# Altium schematic sheet [03]-CONNECTOR,SBC.SchDoc: S32K1_CONTROLLER (part 2 of 3)
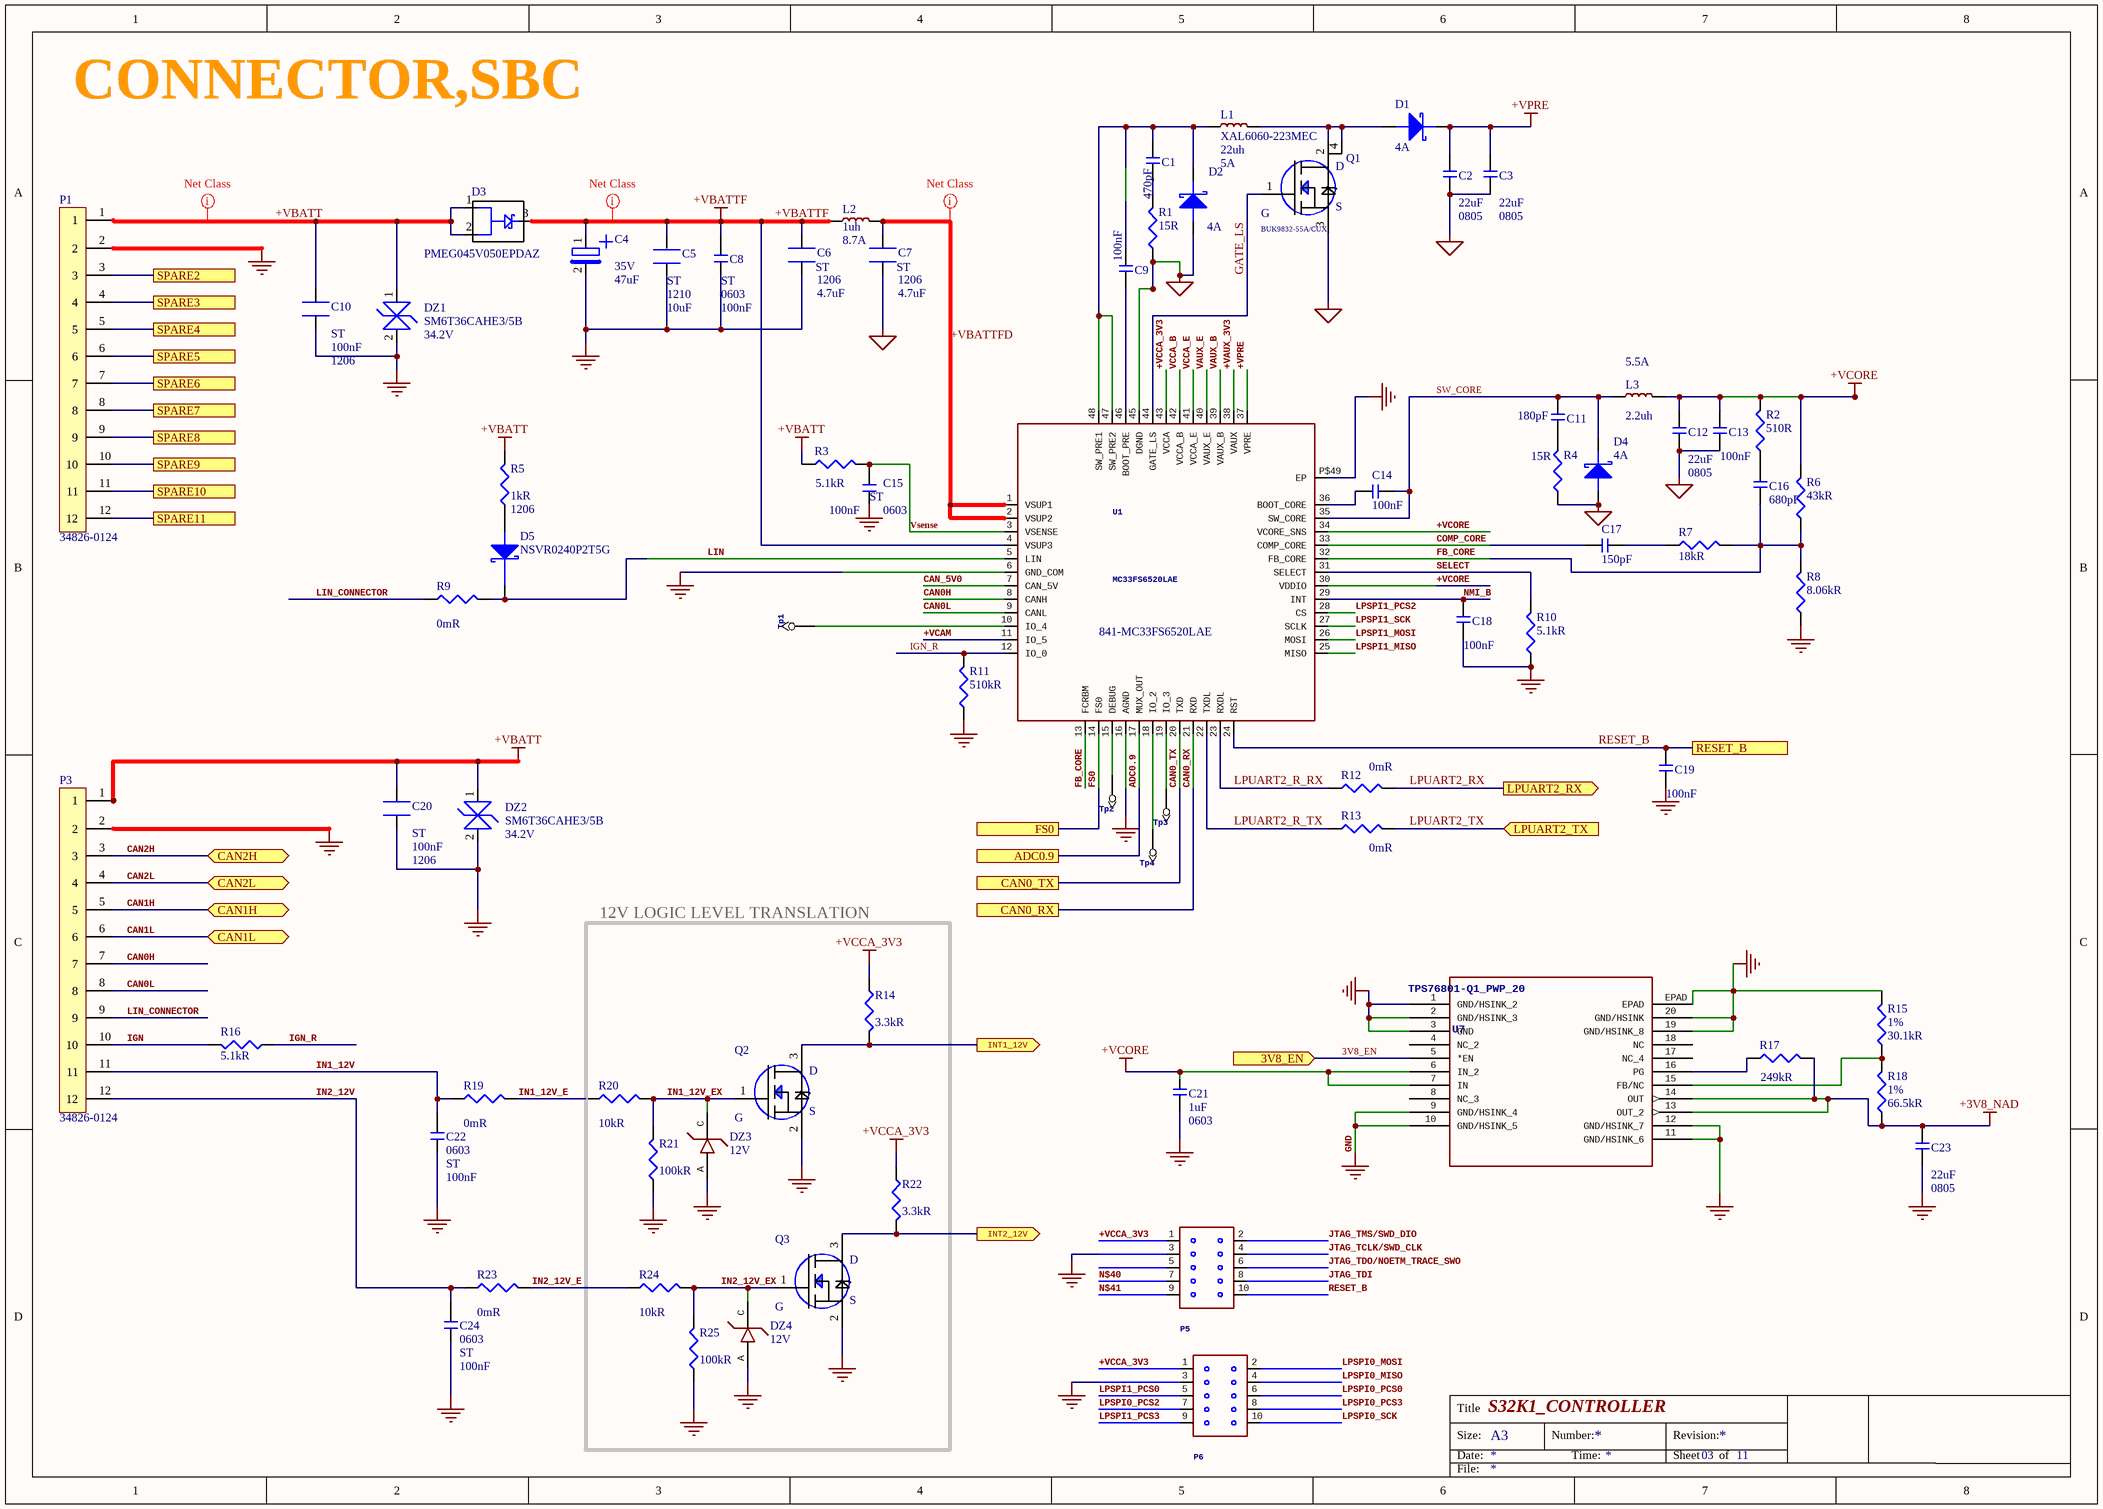
[diagram p1: [03]-CONNECTOR,SBC.SchDoc]
## Library data of the parts
C1 = C0402S471K3RACAUTO: Cap Ceramic 470pF 25V X7R 10% SMD 0402 125°C Paper T/R; Manufacturer: KEMET; Supplier 1: Digikey; Manufacturer Part Number: C0402S471K3RACAUTO; Stock 1: 10000; Pricing 1: 1 = 0.53000, 10 = 0.37200, 100 = 0.24480, 500 = 0.18132, 1000 = 0.15412, 2500 = 0.14506, 5000 = 0.13599 (USD); ComponentLink1URL: http://datasheet.octopart.com/C0402S471K3RACAUTO-KEMET-datasheet-84169754.pdf; ComponentLink1Description: http://datasheet.octopart.com/C0402S471K3RACAUTO-KEMET-datasheet-84169754.pdf; Supplier Part Number 1: 399-19394-1-ND
C2 C3 C12 C23 = GRT21BR61E226ME13L: 0805 22 uF 25 V ±20% Tolerance X5R Multilayer Ceramic Capacitor; Manufacturer: Murata; Voltage Rating: 25V; Supplier 1: Digi-Key; Manufacturer Part Number: GRT21BR61E226ME13L; Stock 1: 494235; Pricing 1: 1 = 0.73000, 10 = 0.51300, 100 = 0.33770, 500 = 0.25018, 1000 = 0.21265 (USD); Mount: Surface Mount; Case Code (Metric): 2012; Case Code (Imperial): 0805; Min Operating Temperature: -55°C; Max Operating Temperature: 85°C; Packaging: Tape and Reel; Tolerance: 20%; Length: 0.079inch; Width: 0.049inch; Thickness: 0.057inch; Ratings: AEC-Q200; ComponentLink1URL: http://datasheet.octopart.com/GRT21BR61E226ME13L-Murata-datasheet-82944879.pdf?src-supplier=Future+Electronics; ComponentLink1Description: http://datasheet.octopart.com/GRT21BR61E226ME13L-Murata-datasheet-82944879.pdf?src-supplier=Future+Electronics; Supplier Part Number 1: 490-12389-1-ND
C4 = EMZA350ADA470MF61G: Aluminum Electrolytic Capacitor 47UF 35V 20%, SMD, Full Reel; Manufacturer: United Chemi-Con; Dielectric Material: Aluminium; Ripple Current: 240mA; Impedance: 360mR; Leakage Current: 3uA; Life (Hours): 2000Hour; Lead Diameter: 0.8mm; Supplier 1: Digi-Key; Manufacturer Part Number: EMZA350ADA470MF61G; Stock 1: 43543; Pricing 1: 1 = 0.70000, 10 = 0.49500, 100 = 0.32600, 500 = 0.24150 (USD); Mount: Surface Mount; Case/Package: Radial; Number of Pins: 61; Min Operating Temperature: -55°C; Max Operating Temperature: 105°C; Tolerance: 20%; Package Quantity: 1; Packaging: Tape and Reel; ESR (Equivalent Series Resistance): 360mR; Voltage Rating (DC): 35V; Ripple Current (AC): 240mA; Termination: SMD/SMT; Voltage: 35V; Diameter: 6.3mm; Length: 5.8mm; Height: 5.8mm; Lead Pitch: 1.9mm; Height - Seated (Max): 0.228inch; REACH SVHC: Unknown; Lead Free: Lead Free; ComponentLink1URL: http://www.farnell.com/datasheets/1470278.pdf?src-supplier=Element14; ComponentLink1Description: http://www.farnell.com/datasheets/1470278.pdf?src-supplier=Element14; ComponentLink2URL: http://datasheet.octopart.com/EMZA350ADA470MF61G-United-Chemi-Con-datasheet-10742166.pdf?src-supplier=Element14; ComponentLink2Description: http://datasheet.octopart.com/EMZA350ADA470MF61G-United-Chemi-Con-datasheet-10742166.pdf?src-supplier=Element14; ComponentLink3URL: http://datasheet.octopart.com/EMZA350ADA470MF61G-United-Chemi-Con-datasheet-23700410.pdf?src-supplier=Newark; ComponentLink3Description: http://datasheet.octopart.com/EMZA350ADA470MF61G-United-Chemi-Con-datasheet-23700410.pdf?src-supplier=Newark; ComponentLink4URL: http://datasheet.octopart.com/EMZA350ADA470MF61G-United-Chemi-Con-datasheet-14460521.pdf?src-supplier=Electro+Sonic; ComponentLink4Description: http://datasheet.octopart.com/EMZA350ADA470MF61G-United-Chemi-Con-datasheet-14460521.pdf?src-supplier=Electro+Sonic; ComponentLink5URL: http://datasheet.octopart.com/EMZA350ADA470MF61G-United-Chemi-Con-datasheet-15930.pdf?src-supplier=Digi-Key; ComponentLink5Description: http://datasheet.octopart.com/EMZA350ADA470MF61G-United-Chemi-Con-datasheet-15930.pdf?src-supplier=Digi-Key; ComponentLink6URL: http://datasheet.octopart.com/EMZA350ADA470MF61G-United-Chemi-Con-datasheet-8459204.pdf?src-supplier=Element14; ComponentLink6Description: http://datasheet.octopart.com/EMZA350ADA470MF61G-United-Chemi-Con-datasheet-8459204.pdf?src-supplier=Element14; ComponentLink7URL: http://datasheet.octopart.com/EMZA350ADA470MF61G-United-Chemi-Con-datasheet-8814951.pdf?src-supplier=Element14; ComponentLink7Description: http://datasheet.octopart.com/EMZA350ADA470MF61G-United-Chemi-Con-datasheet-8814951.pdf?src-supplier=Element14; ComponentLink8URL: http://datasheet.octopart.com/EMZA350ADA470MF61G-United-Chemi-Con-datasheet-21267361.pdf?src-supplier=Newark; ComponentLink8Description: http://datasheet.octopart.com/EMZA350ADA470MF61G-United-Chemi-Con-datasheet-21267361.pdf?src-supplier=Newark; ComponentLink9URL: http://datasheet.octopart.com/EMZA350ADA470MF61G-United-Chemi-Con-datasheet-33025258.pdf?src-supplier=Electro+Sonic; ComponentLink9Description: http://datasheet.octopart.com/EMZA350ADA470MF61G-United-Chemi-Con-datasheet-33025258.pdf?src-supplier=Electro+Sonic; ComponentLink10URL: http://datasheet.octopart.com/EMZA350ADA470MF61G-United-Chemi-Con-datasheet-43457141.pdf?src-supplier=Future+Electronics; ComponentLink10Description: http://datasheet.octopart.com/EMZA350ADA470MF61G-United-Chemi-Con-datasheet-43457141.pdf?src-supplier=Future+Electronics; ComponentLink11URL: http://datasheet.octopart.com/EMZA350ADA470MF61G-United-Chemi-Con-datasheet-62043274.pdf?src-supplier=Electro+Sonic; ComponentLink11Description: http://datasheet.octopart.com/EMZA350ADA470MF61G-United-Chemi-Con-datasheet-62043274.pdf?src-supplier=Electro+Sonic; Supplier Part Number 1: 565-2558-1-ND
C5 = CGA6P3X7S1H106K250AE: Cap Ceramic 10uF 50V X7S 10% Pad SMD 1210 Soft Termination 125C Automotive T/R; Manufacturer: TDK; Supplier 1: Digi-Key; Manufacturer Part Number: CGA6P3X7S1H106K250AE; Stock 1: 58465; Pricing 1: 1 = 1.84000, 10 = 1.44900, 100 = 1.08680, 500 = 0.82110 (USD); Mount: Surface Mount; Case/Package: 1210; Weight: 0.000564oz; Case Code (Metric): 3225; Min Operating Temperature: -55°C; Max Operating Temperature: 125°C; Packaging: Tape and Reel; Voltage Rating: 50V; Voltage Rating (DC): 50V; Tolerance: 10%; Package Quantity: 1000; Dielectric: X7S; Termination: SMD/SMT; Features: Soft Termination; Length: 3.2mm; Height: 2.5mm; Width: 2.5mm; Thickness: 0.11inch; Depth: 2.5mm; Ratings: AEC-Q200; REACH SVHC: No SVHC; Lead Free: Lead Free; ComponentLink1URL: http://www.mouser.com/ds/2/400/lcc_commercial_soft_en-775842.pdf?src-supplier=Mouser; ComponentLink1Description: http://www.mouser.com/ds/2/400/lcc_commercial_soft_en-775842.pdf?src-supplier=Mouser; ComponentLink2URL: http://www.farnell.com/datasheets/1863333.pdf?src-supplier=Element14; ComponentLink2Description: http://www.farnell.com/datasheets/1863333.pdf?src-supplier=Element14; ComponentLink3URL: http://datasheet.octopart.com/CGA6P3X7S1H106K250AE-TDK-datasheet-26765558.pdf?src-supplier=Newark; ComponentLink3Description: http://datasheet.octopart.com/CGA6P3X7S1H106K250AE-TDK-datasheet-26765558.pdf?src-supplier=Newark; ComponentLink4URL: http://datasheet.octopart.com/CGA6P3X7S1H106K250AE-TDK-datasheet-33037363.pdf?src-supplier=Newark; ComponentLink4Description: http://datasheet.octopart.com/CGA6P3X7S1H106K250AE-TDK-datasheet-33037363.pdf?src-supplier=Newark; ComponentLink5URL: http://datasheet.octopart.com/CGA6P3X7S1H106K250AE-TDK-datasheet-82475251.pdf?src-supplier=Newark; ComponentLink5Description: http://datasheet.octopart.com/CGA6P3X7S1H106K250AE-TDK-datasheet-82475251.pdf?src-supplier=Newark; ComponentLink6URL: http://datasheet.octopart.com/CGA6P3X7S1H106K250AE-TDK-datasheet-57863114.pdf?src-supplier=Newark; ComponentLink6Description: http://datasheet.octopart.com/CGA6P3X7S1H106K250AE-TDK-datasheet-57863114.pdf?src-supplier=Newark; ComponentLink7URL: http://datasheet.octopart.com/CGA6P3X7S1H106K250AE-TDK-datasheet-41194876.pdf?src-supplier=Future+Electronics; ComponentLink7Description: http://datasheet.octopart.com/CGA6P3X7S1H106K250AE-TDK-datasheet-41194876.pdf?src-supplier=Future+Electronics; ComponentLink8URL: http://datasheet.octopart.com/CGA6P3X7S1H106K250AE.-TDK-datasheet-33009218.pdf?src-supplier=Newark; ComponentLink8Description: http://datasheet.octopart.com/CGA6P3X7S1H106K250AE.-TDK-datasheet-33009218.pdf?src-supplier=Newark; Supplier Part Number 1: 445-8792-1-ND
C6 C7 = CGA5L3X7R1H475K160AE: Cap Ceramic 4.7uF 50V X7R 10% Pad SMD 1206 Soft Termination 125C Automotive T/R; Manufacturer: TDK; Supplier 1: Digi-Key; Manufacturer Part Number: CGA5L3X7R1H475K160AE; Stock 1: 49519; Pricing 1: 1 = 0.98000, 10 = 0.72500, 100 = 0.49680, 500 = 0.39330, 1000 = 0.33120 (USD); Mount: Surface Mount; Case/Package: 1206; Weight: 0.000571oz; Case Code (Metric): 3216; Min Operating Temperature: -55°C; Max Operating Temperature: 125°C; Packaging: Tape and Reel; Voltage Rating: 50V; Dielectric: X7R; Tolerance: 10%; Termination: SMD/SMT; Voltage Rating (DC): 50V; Package Quantity: 2000; Features: Soft Termination; Length: 0.126inch; Height: 1.6mm; Width: 0.063inch; Thickness: 0.075inch; Ratings: AEC-Q200; REACH SVHC: No SVHC; Lead Free: Lead Free; ComponentLink1URL: http://datasheet.octopart.com/CGA5L3X7R1H475K160AE-TDK-datasheet-57863114.pdf?src-supplier=Newark; ComponentLink1Description: http://datasheet.octopart.com/CGA5L3X7R1H475K160AE-TDK-datasheet-57863114.pdf?src-supplier=Newark; ComponentLink2URL: http://datasheet.octopart.com/CGA5L3X7R1H475K160AE-TDK-datasheet-82475251.pdf?src-supplier=Newark; ComponentLink2Description: http://datasheet.octopart.com/CGA5L3X7R1H475K160AE-TDK-datasheet-82475251.pdf?src-supplier=Newark; ComponentLink3URL: http://datasheet.octopart.com/CGA5L3X7R1H475K160AE-TDK-datasheet-24967704.pdf?src-supplier=Future+Electronics; ComponentLink3Description: http://datasheet.octopart.com/CGA5L3X7R1H475K160AE-TDK-datasheet-24967704.pdf?src-supplier=Future+Electronics; ComponentLink4URL: http://datasheet.octopart.com/CGA5L3X7R1H475K160AE-TDK-datasheet-31895768.pdf?src-supplier=Future+Electronics; ComponentLink4Description: http://datasheet.octopart.com/CGA5L3X7R1H475K160AE-TDK-datasheet-31895768.pdf?src-supplier=Future+Electronics; Supplier Part Number 1: 445-172481-1-ND
C8 C15 C22 C24 = 06035C104K4Z2A: Capacitor: ceramic; MLCC; 100nF; 50V; X7R; ±10%; SMD; 0603; Manufacturer: AVX; Dissipation Factor: 2.5%; Supplier 1: Digi-Key; Manufacturer Part Number: 06035C104K4Z2A; Stock 1: 777100; Pricing 1: 1 = 0.20000, 10 = 0.13600, 100 = 0.06870, 500 = 0.04702, 1000 = 0.04159 (USD); Mount: Surface Mount; Case/Package: 0603; Number of Pins: 2; Case Code (Metric): 1608; Contact Plating: Matte,Tin; Min Operating Temperature: -55°C; Max Operating Temperature: 125°C; Tolerance: 10%; Voltage Rating: 50V; Packaging: Tape and Reel; Package Quantity: 1; Voltage Rating (DC): 50V; Dielectric: X7R; Termination: SMD/SMT; Features: Soft Termination; Length: 1.6mm; Height: 0.035mm; Width: 0.81mm; Thickness: 0.037inch; Depth: 0.81mm; Ratings: AEC-Q200; Radiation Hardening: No; REACH SVHC: No SVHC; Lead Free: Lead Free; ComponentLink1URL: https://www.avx.com/docs/Catalogs/flexiterm.pdf?src-supplier=Avnet+Europe; ComponentLink1Description: https://www.avx.com/docs/Catalogs/flexiterm.pdf?src-supplier=Avnet+Europe; ComponentLink2URL: http://catalogs.avx.com/SurfaceMount.pdf?src-supplier=Digi-Key; ComponentLink2Description: http://catalogs.avx.com/SurfaceMount.pdf?src-supplier=Digi-Key; ComponentLink3URL: https://www.verical.com/server-webapp/html/getDatasheet?partID=494917&src-supplier=Verical; ComponentLink3Description: https://www.verical.com/server-webapp/html/getDatasheet?partID=494917&src-supplier=Verical; ComponentLink4URL: http://www.farnell.com/datasheets/1679506.pdf?src-supplier=Element14; ComponentLink4Description: http://www.farnell.com/datasheets/1679506.pdf?src-supplier=Element14; ComponentLink5URL: http://datasheet.octopart.com/06035C104K4Z2A-AVX-datasheet-12509786.pdf?src-supplier=Newark; ComponentLink5Description: http://datasheet.octopart.com/06035C104K4Z2A-AVX-datasheet-12509786.pdf?src-supplier=Newark; ComponentLink6URL: http://datasheet.octopart.com/06035C104K4Z2A-AVX-datasheet-12587061.pdf?src-supplier=Newark; ComponentLink6Description: http://datasheet.octopart.com/06035C104K4Z2A-AVX-datasheet-12587061.pdf?src-supplier=Newark; ComponentLink7URL: http://datasheet.octopart.com/06035C104K4Z2A-AVX-datasheet-78690206.pdf?src-supplier=Newark; ComponentLink7Description: http://datasheet.octopart.com/06035C104K4Z2A-AVX-datasheet-78690206.pdf?src-supplier=Newark; ComponentLink8URL: http://datasheet.octopart.com/06035C104K4Z2A-AVX-datasheet-8446237.pdf?src-supplier=TME; ComponentLink8Description: http://datasheet.octopart.com/06035C104K4Z2A-AVX-datasheet-8446237.pdf?src-supplier=TME; ComponentLink9URL: http://datasheet.octopart.com/06035C104K4Z2A-AVX-datasheet-8451785.pdf?src-supplier=TME; ComponentLink9Description: http://datasheet.octopart.com/06035C104K4Z2A-AVX-datasheet-8451785.pdf?src-supplier=TME; ComponentLink10URL: http://datasheet.octopart.com/06035C104K4Z2A-AVX-datasheet-50865432.pdf?src-supplier=TME; ComponentLink10Description: http://datasheet.octopart.com/06035C104K4Z2A-AVX-datasheet-50865432.pdf?src-supplier=TME; ComponentLink11URL: http://datasheet.octopart.com/06035C104K4Z2A-AVX-datasheet-167033.pdf?src-supplier=Farnell; ComponentLink11Description: http://datasheet.octopart.com/06035C104K4Z2A-AVX-datasheet-167033.pdf?src-supplier=Farnell; ComponentLink12URL: http://datasheet.octopart.com/06035C104K4Z2A-AVX-datasheet-5313617.pdf?src-supplier=Farnell; ComponentLink12Description: http://datasheet.octopart.com/06035C104K4Z2A-AVX-datasheet-5313617.pdf?src-supplier=Farnell; ComponentLink13URL: http://datasheet.octopart.com/06035C104K4Z2A-AVX-datasheet-8113618.pdf?src-supplier=Farnell; ComponentLink13Description: http://datasheet.octopart.com/06035C104K4Z2A-AVX-datasheet-8113618.pdf?src-supplier=Farnell; ComponentLink14URL: http://datasheet.octopart.com/06035C104K4Z2A-AVX-Interconnect---Elco-datasheet-8458193.pdf?src-supplier=Factory+Futures; ComponentLink14Description: http://datasheet.octopart.com/06035C104K4Z2A-AVX-Interconnect---Elco-datasheet-8458193.pdf?src-supplier=Factory+Futures; ComponentLink15URL: http://datasheet.octopart.com/06035C104K4Z2A-AVX-datasheet-26446220.pdf?src-supplier=Newark; ComponentLink15Description: http://datasheet.octopart.com/06035C104K4Z2A-AVX-datasheet-26446220.pdf?src-supplier=Newark; ComponentLink16URL: http://datasheet.octopart.com/06035C104K4Z2A-AVX-datasheet-540940.pdf?src-supplier=Future+Electronics; ComponentLink16Description: http://datasheet.octopart.com/06035C104K4Z2A-AVX-datasheet-540940.pdf?src-supplier=Future+Electronics; ComponentLink17URL: http://datasheet.octopart.com/06035C104K4Z2A-AVX-datasheet-5313949.pdf?src-supplier=Future+Electronics; ComponentLink17Description: http://datasheet.octopart.com/06035C104K4Z2A-AVX-datasheet-5313949.pdf?src-supplier=Future+Electronics; ComponentLink18URL: http://datasheet.octopart.com/06035C104K4Z2A-AVX-datasheet-65931687.pdf?src-supplier=Element14; ComponentLink18Description: http://datasheet.octopart.com/06035C104K4Z2A-AVX-datasheet-65931687.pdf?src-supplier=Element14; ComponentLink19URL: http://datasheet.octopart.com/06035C104K4Z2A-AVX-datasheet-13516023.pdf; ComponentLink19Description: http://datasheet.octopart.com/06035C104K4Z2A-AVX-datasheet-13516023.pdf; Supplier Part Number 1: 478-6344-1-ND
C9 C13 C14 C18 C19 = GCM155R71C104KA55D: Multilayer Ceramic Capacitors (MLCC) - SMD/SMT 0402 0.1uF 16volts X7R 10%; Manufacturer: Murata; Voltage Rating: 16V; Supplier 1: Arrow; Manufacturer Part Number: GCM155R71C104KA55D; Stock 1: 10660000; Pricing 1: 10000 = 0.01910, 1 = 0.05560, 10 = 0.04750, 25 = 0.03370, 100 = 0.02190, 250 = 0.02080 (USD); Mount: Surface Mount; Case/Package: 0402; Case Code (Metric): 1005; Case Code (Imperial): 0402; Min Operating Temperature: -55°C; Max Operating Temperature: 125°C; Package Quantity: 1; Tolerance: 10%; Packaging: Tape and Reel; Dielectric: X7R; Voltage Rating (DC): 16V; Termination: SMD/SMT; Voltage: 16V; Length: 1mm; Height: 0.5mm; Width: 0.02inch; Thickness: 0.022inch; Depth: 0.5mm; Ratings: AEC-Q200; Radiation Hardening: No; REACH SVHC: No SVHC; Lead Free: Lead Free; ComponentLink1URL: http://psearch.en.murata.com/capacitor/product/GCM155R71C104KA55%23.pdf?src-supplier=Avnet; ComponentLink1Description: http://psearch.en.murata.com/capacitor/product/GCM155R71C104KA55%23.pdf?src-supplier=Avnet; ComponentLink2URL: http://search.murata.co.jp/Ceramy/image/img/A01X/partnumbering_e_02.pdf?src-supplier=Digi-Key; ComponentLink2Description: http://search.murata.co.jp/Ceramy/image/img/A01X/partnumbering_e_02.pdf?src-supplier=Digi-Key; ComponentLink3URL: http://uk.rs-online.com/webdocs/1423/0900766b81423e06.pdf?src-supplier=RSComponents; ComponentLink3Description: http://uk.rs-online.com/webdocs/1423/0900766b81423e06.pdf?src-supplier=RSComponents; ComponentLink4URL: https://www.verical.com/server-webapp/html/getDatasheet?partID=220774&src-supplier=Verical; ComponentLink4Description: https://www.verical.com/server-webapp/html/getDatasheet?partID=220774&src-supplier=Verical; ComponentLink5URL: http://datasheet.octopart.com/GCM155R71C104KA55D-Murata-datasheet-11777063.pdf?src-supplier=_legacy+Avnet; ComponentLink5Description: http://datasheet.octopart.com/GCM155R71C104KA55D-Murata-datasheet-11777063.pdf?src-supplier=_legacy+Avnet; ComponentLink6URL: http://datasheet.octopart.com/GCM155R71C104KA55D-Murata-datasheet-14404342.pdf?src-supplier=Future+Electronics; ComponentLink6Description: http://datasheet.octopart.com/GCM155R71C104KA55D-Murata-datasheet-14404342.pdf?src-supplier=Future+Electronics; ComponentLink7URL: http://datasheet.octopart.com/GCM155R71C104KA55D-Murata-datasheet-12515163.pdf?src-supplier=Farnell; ComponentLink7Description: http://datasheet.octopart.com/GCM155R71C104KA55D-Murata-datasheet-12515163.pdf?src-supplier=Farnell; ComponentLink8URL: http://datasheet.octopart.com/GCM155R71C104KA55D-Murata-datasheet-44104237.pdf?src-supplier=Future+Electronics; ComponentLink8Description: http://datasheet.octopart.com/GCM155R71C104KA55D-Murata-datasheet-44104237.pdf?src-supplier=Future+Electronics; ComponentLink9URL: http://datasheet.octopart.com/GCM155R71C104KA55D-Murata-datasheet-62117434.pdf?src-supplier=TME; ComponentLink9Description: http://datasheet.octopart.com/GCM155R71C104KA55D-Murata-datasheet-62117434.pdf?src-supplier=TME; Supplier Part Number 1: GCM155R71C104KA55D
C10 C20 = C1206X104K2RACAUTO: Cap Ceramic 0.1uF 200V X7R 10% Pad SMD 1206 Flexible Termination 125C Automotive Medical T/R; Manufacturer: KEMET; Supplier 1: Digi-Key; Manufacturer Part Number: C1206X104K2RACAUTO; Stock 1: 17486; Pricing 1: 1 = 0.82000, 10 = 0.60800, 100 = 0.41660, 500 = 0.32984, 1000 = 0.27777 (USD); Mount: Surface Mount; Case Code (Imperial): 1206; Case Code (Metric): 3216; Dielectric Material: Ceramic; Min Operating Temperature: -55°C; Max Operating Temperature: 125°C; Packaging: Tape and Reel; Tolerance: 10%; Voltage Rating: 200V; Dielectric: X7R; Termination: SMD/SMT; Voltage Rating (DC): 200V; Features: Soft Termination; Length: 0.13inch; Width: 0.063inch; Thickness: 0.055inch; Depth: 1.6mm; Ratings: AEC-Q200; ComponentLink1URL: http://datasheet.octopart.com/C1206X104K2RACAUTO-KEMET-datasheet-101607918.pdf?src-supplier=Farnell; ComponentLink1Description: http://datasheet.octopart.com/C1206X104K2RACAUTO-KEMET-datasheet-101607918.pdf?src-supplier=Farnell; ComponentLink2URL: http://datasheet.octopart.com/C1206X104K2RACAUTO-KEMET-datasheet-84169754.pdf; ComponentLink2Description: http://datasheet.octopart.com/C1206X104K2RACAUTO-KEMET-datasheet-84169754.pdf; Supplier Part Number 1: 399-12986-1-ND
C11 = UMK105CH181JVHF: Cap Ceramic 180pF 50V 0402; Manufacturer: Taiyo Yuden; Supplier 1: Digikey; Manufacturer Part Number: UMK105CH181JVHF; Stock 1: 1875; Pricing 1: 1 = 0.10000, 10 = 0.05600, 100 = 0.02500, 500 = 0.01790, 1000 = 0.01406, 2500 = 0.01278, 5000 = 0.01176 (USD); Supplier Part Number 1: 587-5073-1-ND
C16 = C0402C681K5RACAUTO: Cap Ceramic 680pF 50V X7R 10% SMD 0402 125°C Punched Paper T/R; Manufacturer: KEMET; Supplier 1: Digi-Key; Manufacturer Part Number: C0402C681K5RACAUTO; Stock 1: 85945; Pricing 1: 1 = 0.12000, 10 = 0.08400, 100 = 0.03960, 500 = 0.02778, 1000 = 0.02300, 2500 = 0.02140, 5000 = 0.01958 (USD); Case/Package: 0402; Dielectric Material: Ceramic; Voltage Rating (DC): 50V; Dielectric: X7R; Tolerance: 10%; ComponentLink1URL: http://datasheet.octopart.com/C0402C681K5RACAUTO-KEMET-datasheet-84169754.pdf; ComponentLink1Description: http://datasheet.octopart.com/C0402C681K5RACAUTO-KEMET-datasheet-84169754.pdf
C17 = GCM1555C1H151JA16D: 0402 150 pF 50 V ±5 % Tolerance C0G SMT Multilayer Ceramic Capacitor; Manufacturer: Murata; Voltage Rating: 50V; Tolerance: 5%; Supplier 1: Arrow; Manufacturer Part Number: GCM1555C1H151JA16D; Stock 1: 10000; Pricing 1: 1 = 0.01650 (USD); Mount: Surface Mount; Case/Package: 0402; Case Code (Metric): 1005; Case Code (Imperial): 0402; Min Operating Temperature: -55°C; Max Operating Temperature: 125°C; Package Quantity: 1; Packaging: Tape and Reel; Dielectric: C0G; Voltage Rating (DC): 50V; Termination: SMD/SMT; Voltage: 50V; Length: 1mm; Height: 0.5mm; Width: 0.02inch; Thickness: 0.022inch; Depth: 0.5mm; Ratings: AEC-Q200; Radiation Hardening: No; Lead Free: Lead Free; ComponentLink1URL: http://search.murata.co.jp/Ceramy/image/img/A01X/partnumbering_e_02.pdf?src-supplier=Digi-Key; ComponentLink1Description: http://search.murata.co.jp/Ceramy/image/img/A01X/partnumbering_e_02.pdf?src-supplier=Digi-Key; ComponentLink2URL: http://datasheet.octopart.com/GCM1555C1H151JA16D-Murata-datasheet-11974918.pdf?src-supplier=Arrow; ComponentLink2Description: http://datasheet.octopart.com/GCM1555C1H151JA16D-Murata-datasheet-11974918.pdf?src-supplier=Arrow; ComponentLink3URL: http://datasheet.octopart.com/GCM1555C1H151JA16D-Murata-datasheet-14404323.pdf; ComponentLink3Description: http://datasheet.octopart.com/GCM1555C1H151JA16D-Murata-datasheet-14404323.pdf; ComponentLink4URL: http://datasheet.octopart.com/GCM1555C1H151JA16D-Murata-datasheet-42223911.pdf?src-supplier=Future+Electronics; ComponentLink4Description: http://datasheet.octopart.com/GCM1555C1H151JA16D-Murata-datasheet-42223911.pdf?src-supplier=Future+Electronics
C21 = CGA3E1X7R1C105K080AC: CGA Series 0603 1 uF 16 V ±10 % Tolerance X7R SMT Multilayer Ceramic Capacitor; Manufacturer: TDK; Tolerance: 10%; Voltage Rating: 16V; Supplier 1: Digi-Key; Manufacturer Part Number: CGA3E1X7R1C105K080AC; Stock 1: 369291; Pricing 1: 1 = 0.15000, 10 = 0.10900, 100 = 0.05110, 500 = 0.03580, 1000 = 0.02963 (USD); Mount: Surface Mount; Weight: 7.1E-05oz; Case Code (Metric): 1608; Case Code (Imperial): 0603; Min Operating Temperature: -55°C; Max Operating Temperature: 125°C; Package Quantity: 4000; Packaging: Tape and Reel; Dielectric: X7R; Termination: SMD/SMT; Voltage Rating (DC): 16V; Length: 0.063inch; Height: 0.8mm; Width: 0.8mm; Thickness: 0.035inch; Ratings: AEC-Q200; REACH SVHC: No SVHC; Lead Free: Lead Free; ComponentLink1URL: http://datasheet.octopart.com/CGA3E1X7R1C105K080AC-TDK-datasheet-43366117.pdf?src-supplier=Newark; ComponentLink1Description: http://datasheet.octopart.com/CGA3E1X7R1C105K080AC-TDK-datasheet-43366117.pdf?src-supplier=Newark; ComponentLink2URL: http://datasheet.octopart.com/CGA3E1X7R1C105K080AC-TDK-datasheet-82475251.pdf?src-supplier=Newark; ComponentLink2Description: http://datasheet.octopart.com/CGA3E1X7R1C105K080AC-TDK-datasheet-82475251.pdf?src-supplier=Newark
D1 D2 D4 = SSB43LHE3_A/I: Diode Schottky Rectifier 30V 4A 2-Pin DO-214AA Plastic T/R; Manufacturer: Vishay; Supplier 1: Mouser; Manufacturer Part Number: SSB43LHE3_A/I; Stock 1: 2659; Pricing 1: 10000 = 0.17300 (USD); Mount: Surface Mount; Packaging: Tape and Reel; Max Reverse Voltage (DC): 30V; Supplier Part Number 1: 78-SSB43LHE3_A/I
D3 = PMEG045V050EPDAZ: Diode Schottky Rectifier 45V 5A 3-Pin SOT-1289 T/R; Manufacturer: Nexperia; Supplier 1: Digikey; Manufacturer Part Number: PMEG045V050EPDAZ; Stock 1: 5000; Pricing 1: 1 = 0.69000, 10 = 0.60700, 100 = 0.46520, 500 = 0.36772, 1000 = 0.29417 (USD); ComponentLink1URL: http://datasheet.octopart.com/PMEG045V050EPDAZ-Nexperia-datasheet-87844653.pdf?src-supplier=Nexperia; ComponentLink1Description: http://datasheet.octopart.com/PMEG045V050EPDAZ-Nexperia-datasheet-87844653.pdf?src-supplier=Nexperia; ComponentLink2URL: http://datasheet.octopart.com/PMEG045V050EPDAZ-NXP-Semiconductors-datasheet-27240176.pdf?src-supplier=NXP+Semiconductors; ComponentLink2Description: http://datasheet.octopart.com/PMEG045V050EPDAZ-NXP-Semiconductors-datasheet-27240176.pdf?src-supplier=NXP+Semiconductors; Supplier Part Number 1: 1727-7634-1-ND
D5 = NSVR0240P2T5G: Diode Schottky Barrier Diode 40V 0.2A 2-Pin SOD-923 T/R; Manufacturer: ON Semiconductor; Average Rectified Current: 200mA; Supplier 1: Mouser; Manufacturer Part Number: NSVR0240P2T5G; Stock 1: 7618; Pricing 1: 1 = 0.42000, 10 = 0.31700, 50 = 0.31700, 100 = 0.17200, 1000 = 0.12900, 10000 = 0.10400 (USD); Mount: Surface Mount; Packaging: Tape and Reel; Max Reverse Voltage (DC): 40V; Lead Free: Lead Free; ComponentLink1URL: http://datasheet.octopart.com/NSVR0240P2T5G-ON-Semiconductor-datasheet-13705431.pdf?src-supplier=ON+Semiconductor; ComponentLink1Description: http://datasheet.octopart.com/NSVR0240P2T5G-ON-Semiconductor-datasheet-13705431.pdf?src-supplier=ON+Semiconductor; Supplier Part Number 1: 863-NSVR0240P2T5G
DZ1 DZ2 = SM6T36CAHE3/5B: Diode TVS Single Bi-Dir 30.8V 600W Automotive 2-Pin SMB T/R; Manufacturer: Vishay; Direction: Bidirectional; Max Surge Current: 62A; Clamping Voltage: 64.3V; Number of Bidirectional Channels: 1; Power Line Protection: No; Max Reverse Leakage Current: 1uA; Test Current: 1mA; Supplier 1: Arrow; Manufacturer Part Number: SM6T36CAHE3/5B; Stock 1: 3200; Pricing 1: 1 = 0.55000, 10 = 0.43500, 25 = 0.42950, 100 = 0.33080, 250 = 0.32720, 500 = 0.28520, 1000 = 0.22660, 3000 = 0.22650 (USD); Mount: Surface Mount; Case/Package: SMB; Number of Pins: 2; Contact Plating: Matte,Tin; Min Operating Temperature: -65°C; Max Operating Temperature: 150°C; Package Quantity: 3200; Operating Supply Voltage: 30.8V; Packaging: Tape and Reel; Reverse Breakdown Voltage: 34.2V; Polarity: Bidirectional; Peak Pulse Power: 600W; Reverse Standoff Voltage: 30.8V; Min Breakdown Voltage: 34.2V; Number of Elements: 1; Peak Pulse Current: 62A; Element Configuration: Single; Leakage Current: 1uA; ESD Protection: No; Composition: Zener; Radiation Hardening: No; Supplier Part Number 1: SM6T36CAHE3/5B
DZ3 DZ4 = SZMMBZ5242BL**G: Manufacturer: ON Semiconductor; Manufacturer Part Number: SZMMBZ5242BLT1G; GateName_1: G$1; SymbolName_1: ZENNER; Tolerance: 5%; Max Power Dissipation: 225mW; Impedance: 30R; Max Reverse Leakage Current: 1uA; Element Configuration: Single; LibraryName: MINI50; DeviceSetName: SZMMBZ5242BL**G; Supplier 1: Newark; Stock 1: 2015; Pricing 1: 1 = 0.16200, 25 = 0.15000, 50 = 0.11600, 100 = 0.08200, 250 = 0.06700, 500 = 0.05100, 1000 = 0.03500 (USD); Case/Package: SOT-23-3; Number of Pins: 3; Min Operating Temperature: -65°C; Max Operating Temperature: 150°C; Package Quantity: 3000; Packaging: Tape and Reel; Voltage Tolerance: 5%; Radiation Hardening: No; Lead Free: Lead Free; ComponentLink1URL: http://www.onsemi.com/pub_link/Collateral/MMBZ5221BLT1-D.PDF?src-supplier=Digi-Key; ComponentLink1Description: http://www.onsemi.com/pub_link/Collateral/MMBZ5221BLT1-D.PDF?src-supplier=Digi-Key; ComponentLink2URL: http://datasheet.octopart.com/SZMMBZ5242BLT1G-ON-Semiconductor-datasheet-10741849.pdf?src-supplier=Future+Electronics; ComponentLink2Description: http://datasheet.octopart.com/SZMMBZ5242BLT1G-ON-Semiconductor-datasheet-10741849.pdf?src-supplier=Future+Electronics; ComponentLink3URL: http://datasheet.octopart.com/SZMMBZ5242BLT1G-ON-Semiconductor-datasheet-109277.pdf?src-supplier=ON+Semiconductor; ComponentLink3Description: http://datasheet.octopart.com/SZMMBZ5242BLT1G-ON-Semiconductor-datasheet-109277.pdf?src-supplier=ON+Semiconductor; ComponentLink4URL: http://datasheet.octopart.com/SZMMBZ5242BLT1G-ON-Semiconductor-datasheet-78758894.pdf?src-supplier=Newark; ComponentLink4Description: http://datasheet.octopart.com/SZMMBZ5242BLT1G-ON-Semiconductor-datasheet-78758894.pdf?src-supplier=Newark; Supplier Part Number 1: 13AC6258
L1 = XAL6060-223MEC: Power inductor, shielded, 20% tol, SMT, RoHS, halogen f; Manufacturer: Coilcraft; Core Material: Composite; Self Resonant Frequency: 9MHz; DC Resistance (DCR): 60.63mR; Test Frequency: 100kHz; Saturation Current: 5.6A; Supplier 1: Mouser; Manufacturer Part Number: XAL6060-223MEC; Stock 1: 19462; Pricing 1: 1 = 2.58000, 10 = 2.58000, 50 = 2.58000, 100 = 2.25000, 1000 = 1.18000, 10000 = 1.18000 (USD); Mount: Surface Mount; Case/Package: SMD/SMT; Min Operating Temperature: -40°C; Max Operating Temperature: 125°C; Packaging: Tape and Reel; Package Quantity: 250; Tolerance: 20%; Shielding: Shielded; Termination: SMD/SMT; Inductance Tolerance: 20%; RMS Current (Irms): 5A; Length: 6.76mm; Height: 6.1mm; Width: 6.56mm; Lead Free: Contains Lead; REACH SVHC: No SVHC; ComponentLink1URL: http://www.mouser.com/ds/2/597/xal60xx-270658.pdf?src-supplier=Mouser; ComponentLink1Description: http://www.mouser.com/ds/2/597/xal60xx-270658.pdf?src-supplier=Mouser; ComponentLink2URL: http://www.farnell.com/datasheets/1681993.pdf?src-supplier=Element14; ComponentLink2Description: http://www.farnell.com/datasheets/1681993.pdf?src-supplier=Element14; ComponentLink3URL: http://datasheet.octopart.com/XAL6060-223MEC-Coilcraft-datasheet-10791337.pdf?src-supplier=Coilcraft+Direct; ComponentLink3Description: http://datasheet.octopart.com/XAL6060-223MEC-Coilcraft-datasheet-10791337.pdf?src-supplier=Coilcraft+Direct; ComponentLink4URL: http://datasheet.octopart.com/XAL6060-223MEC-Coilcraft-datasheet-14354382.pdf?src-supplier=Newark; ComponentLink4Description: http://datasheet.octopart.com/XAL6060-223MEC-Coilcraft-datasheet-14354382.pdf?src-supplier=Newark; Supplier Part Number 1: 994-XAL6060-223MEC
L2 = XAL4020-102MEB: Power inductor, shielded, 20% tol, SMT, RoHS, halogen f; Manufacturer: Coilcraft; Core Material: Composite; Self Resonant Frequency: 79MHz; Max DC Current: 9.6A; DC Resistance (DCR): 14.6mR; Test Frequency: 100kHz; Supplier 1: Mouser; Manufacturer Part Number: XAL4020-102MEB; Stock 1: 5843; Pricing 1: 1 = 1.80000, 10 = 1.50000, 50 = 1.46000, 100 = 1.44000, 1000 = 0.87000, 10000 = 0.87000 (USD); Mount: Surface Mount; Case/Package: SMD/SMT; Min Operating Temperature: -40°C; Max Operating Temperature: 125°C; Packaging: Tape and Reel; Package Quantity: 20; Tolerance: 20%; Shielding: Shielded; Termination: SMD/SMT; Inductance Tolerance: 20%; RMS Current (Irms): 9.6A; Length: 4.3mm; Height: 2.1mm; Width: 4.3mm; Lead Free: Contains Lead; REACH SVHC: No SVHC; ComponentLink1URL: http://www.mouser.com/ds/2/597/xal4000-270751.pdf?src-supplier=Mouser; ComponentLink1Description: http://www.mouser.com/ds/2/597/xal4000-270751.pdf?src-supplier=Mouser; ComponentLink2URL: http://www.farnell.com/datasheets/1681987.pdf?src-supplier=Element14; ComponentLink2Description: http://www.farnell.com/datasheets/1681987.pdf?src-supplier=Element14; ComponentLink3URL: http://datasheet.octopart.com/XAL4020-102MEB-Coilcraft-datasheet-10791550.pdf?src-supplier=Coilcraft+Direct; ComponentLink3Description: http://datasheet.octopart.com/XAL4020-102MEB-Coilcraft-datasheet-10791550.pdf?src-supplier=Coilcraft+Direct; ComponentLink4URL: http://datasheet.octopart.com/XAL4020-102MEB-Coilcraft-datasheet-14354380.pdf?src-supplier=Newark; ComponentLink4Description: http://datasheet.octopart.com/XAL4020-102MEB-Coilcraft-datasheet-14354380.pdf?src-supplier=Newark; Supplier Part Number 1: 994-XAL4020-102MEB
L3 = XAL4020-222MEB: Power inductor, shielded, 20% tol, SMT, RoHS, halogen f; Manufacturer: Coilcraft; Core Material: Composite; Self Resonant Frequency: 52MHz; DC Resistance (DCR): 38.7mR; Test Frequency: 100kHz; Supplier 1: Mouser; Manufacturer Part Number: XAL4020-222MEB; Stock 1: 5295; Pricing 1: 1 = 1.80000, 10 = 1.50000, 50 = 1.46000, 100 = 1.44000, 1000 = 0.87000, 10000 = 0.87000 (USD); Min Operating Temperature: -40°C; Max Operating Temperature: 125°C; Tolerance: 20%; Shielding: Shielded; Packaging: Cut Tape; Termination: SMD/SMT; Length: 4.3mm; Height: 2.1mm; Width: 4.3mm; Lead Free: Contains Lead; ComponentLink1URL: http://www.mouser.com/ds/2/597/xal4000-270751.pdf?src-supplier=Mouser; ComponentLink1Description: http://www.mouser.com/ds/2/597/xal4000-270751.pdf?src-supplier=Mouser; ComponentLink2URL: http://datasheet.octopart.com/XAL4020-222MEB-Coilcraft-datasheet-10791550.pdf?src-supplier=Coilcraft+Direct; ComponentLink2Description: http://datasheet.octopart.com/XAL4020-222MEB-Coilcraft-datasheet-10791550.pdf?src-supplier=Coilcraft+Direct; Supplier Part Number 1: 994-XAL4020-222MEB
P1 P3 = 34826-0124: Mini50™ Unsealed, Dual Row, Right-Angle Header, 12 Circuit, Polarization Option A, Black, Tray; Manufacturer: Molex; Current Rating: 3A; Voltage Rating: 500V; Number of Positions: 12; Gender: Male; Pitch: 2mm; Glow Wire Compliant: Non-compliant; Supplier 1: Digi-Key; Manufacturer Part Number: 34826-0124; Stock 1: 2751; Pricing 1: 1 = 1.65000, 10 = 1.50100, 100 = 1.28650, 520 = 1.07206, 1040 = 0.91890, 5200 = 0.81476, 10400 = 0.79638 (USD); Mount: Surface Mount; Case/Package: 0124; Contact Plating: Nickel,Tin; Color: Black; Contact Material: Brass; Housing Material: Polyester; Min Operating Temperature: -40°C; Max Operating Temperature: 105°C; Number of Rows: 2; Packaging: Tray; Package Quantity: 520; Termination: Solder; Number of Contacts: 12; Orientation: Right Angle; Number of Circuits: 12; REACH SVHC: Unknown; Halogen Free: Low Halogen; ComponentLink1URL: http://www.farnell.com/datasheets/1780813.pdf?src-supplier=Element14; ComponentLink1Description: http://www.farnell.com/datasheets/1780813.pdf?src-supplier=Element14; ComponentLink2URL: http://datasheet.octopart.com/34826-0124-Molex-datasheet-20772911.pdf?src-supplier=Molex; ComponentLink2Description: http://datasheet.octopart.com/34826-0124-Molex-datasheet-20772911.pdf?src-supplier=Molex; ComponentLink3URL: http://sigma.octopart.com/20772913/technical_drawing/Molex-348260124.pdf?src-supplier=Molex; ComponentLink3Description: http://sigma.octopart.com/20772913/technical_drawing/Molex-348260124.pdf?src-supplier=Molex; ComponentLink4URL: http://datasheet.octopart.com/34826-0124-Molex-datasheet-21395142.pdf?src-supplier=Farnell; ComponentLink4Description: http://datasheet.octopart.com/34826-0124-Molex-datasheet-21395142.pdf?src-supplier=Farnell; ComponentLink5URL: http://datasheet.octopart.com/34826-0124-Molex-datasheet-77557790.pdf?src-supplier=Newark; ComponentLink5Description: http://datasheet.octopart.com/34826-0124-Molex-datasheet-77557790.pdf?src-supplier=Newark; ComponentLink6URL: http://datasheet.octopart.com/34826-0124-Molex-datasheet-37169430.pdf?src-supplier=Electro+Sonic; ComponentLink6Description: http://datasheet.octopart.com/34826-0124-Molex-datasheet-37169430.pdf?src-supplier=Electro+Sonic; ComponentLink7URL: http://datasheet.octopart.com/34826-0124-Molex-datasheet-41339625.pdf?src-supplier=Newark; ComponentLink7Description: http://datasheet.octopart.com/34826-0124-Molex-datasheet-41339625.pdf?src-supplier=Newark; ComponentLink8URL: http://datasheet.octopart.com/34826-0124-Molex-datasheet-41568714.pdf?src-supplier=Newark; ComponentLink8Description: http://datasheet.octopart.com/34826-0124-Molex-datasheet-41568714.pdf?src-supplier=Newark; ComponentLink9URL: http://datasheet.octopart.com/34826-0124-Molex-datasheet-56953327.pdf?src-supplier=Electro+Sonic; ComponentLink9Description: http://datasheet.octopart.com/34826-0124-Molex-datasheet-56953327.pdf?src-supplier=Electro+Sonic; ComponentLink10URL: http://datasheet.octopart.com/34826-0124-Molex-datasheet-62280374.pdf?src-supplier=Electro+Sonic; ComponentLink10Description: http://datasheet.octopart.com/34826-0124-Molex-datasheet-62280374.pdf?src-supplier=Electro+Sonic; ComponentLink11URL: http://datasheet.octopart.com/34826-0124-Molex-datasheet-66635110.pdf?src-supplier=Element14; ComponentLink11Description: http://datasheet.octopart.com/34826-0124-Molex-datasheet-66635110.pdf?src-supplier=Element14; Supplier Part Number 1: WM10328-ND
P5 P6 = FTSH105-05: GateName_1: G$1; SymbolName_1: FTSH105-05; LibraryName: WeOnReferencePlatform; DeviceSetName: FTSH105-05
Q1 = BUK9832-55A/CUX: BUK9832 Series 55 V 32 mOhm N-Channel TrenchMOS Logic Level FET - SOT-223; Manufacturer: Nexperia; Supplier 1: Digi-Key; Manufacturer Part Number: BUK9832-55A/CUX; Stock 1: 84864; Pricing 1: 1 = 0.79000, 10 = 0.69400, 100 = 0.53540, 500 = 0.39660 (USD); ComponentLink1URL: http://datasheet.octopart.com/BUK9832-55A-CUX-Nexperia-datasheet-87843131.pdf?src-supplier=Future+Electronics; ComponentLink1Description: http://datasheet.octopart.com/BUK9832-55A-CUX-Nexperia-datasheet-87843131.pdf?src-supplier=Future+Electronics; ComponentLink2URL: http://datasheet.octopart.com/BUK9832-55A-CUX-NXP-Semiconductors-datasheet-10127705.pdf?src-supplier=NXP+Semiconductors; ComponentLink2Description: http://datasheet.octopart.com/BUK9832-55A-CUX-NXP-Semiconductors-datasheet-10127705.pdf?src-supplier=NXP+Semiconductors; Supplier Part Number 1: 1727-2226-1-ND
Q2 Q3 = BSS138BKW,115: BSS138BKW - 60 V, 320 mA N-channel Trench MOSFET; Manufacturer: Nexperia; Supplier 1: Digi-Key; Manufacturer Part Number: BSS138BKW,115; Stock 1: 57000; Pricing 1: 3000 = 0.06755 (USD); ComponentLink1URL: http://datasheet.octopart.com/BSS138BKW%2C115-Nexperia-datasheet-86648463.pdf?src-supplier=Future+Electronics; ComponentLink1Description: http://datasheet.octopart.com/BSS138BKW%2C115-Nexperia-datasheet-86648463.pdf?src-supplier=Future+Electronics; ComponentLink2URL: http://datasheet.octopart.com/BSS138BKW%2C115-Nexperia-datasheet-10411339.pdf?src-supplier=NXP+Semiconductors; ComponentLink2Description: http://datasheet.octopart.com/BSS138BKW%2C115-Nexperia-datasheet-10411339.pdf?src-supplier=NXP+Semiconductors; ComponentLink3URL: http://datasheet.octopart.com/BSS138BKW%2C115-NXP-Semiconductors-datasheet-11836202.pdf?src-supplier=Arrow; ComponentLink3Description: http://datasheet.octopart.com/BSS138BKW%2C115-NXP-Semiconductors-datasheet-11836202.pdf?src-supplier=Arrow; Supplier Part Number 1: 1727-1262-2-ND; Supplier 2: Mouser; Stock 2: 57224; Pricing 2: 1 = 0.36000, 10 = 0.24100, 50 = 0.24100, 100 = 0.10100, 1000 = 0.06900, 10000 = 0.04600 (USD); Supplier Part Number 2: 771-BSS138BKW115
R1 R4 = ERJ-2GEJ150X: Res Thick Film 0402 15 Ohm 5% 1/10W ±200ppm/°C Molded SMD SMD Punched Carrier T/R; Manufacturer: Panasonic; Voltage Rating: 50V; Power Rating: 100mW; Supplier 1: Arrow; Manufacturer Part Number: ERJ-2GEJ150X; Stock 1: 16044; Pricing 1: 1 = 0.00250, 100 = 0.00230, 6000 = 0.00220 (USD); Mount: Surface Mount; Case/Package: 0402; Case Code (Imperial): 0402; Case Code (Metric): 1005; Contact Plating: Tin; Min Operating Temperature: -55°C; Max Operating Temperature: 155°C; Packaging: Tape and Reel; Tolerance: 5%; Package Quantity: 1; Termination: SMD/SMT; Composition: Thick Film; Number of Terminations: 2; Temperature Coefficient: 200ppm/°C; Military Standard: Not; Max Power Dissipation: 100mW; Voltage Rating (DC): 50V; Features: Automotive AEC-Q200; Length: 1mm; Height: 0.35mm; Width: 0.5mm; Depth: 0.5mm; Radiation Hardening: No; REACH SVHC: No SVHC; Lead Free: Lead Free; ComponentLink1URL: https://www.alliedelec.com/m/d/51cd0790071e1666bdb9d00c57fcf960.pdf?src-supplier=Allied+Electronics; ComponentLink1Description: https://www.alliedelec.com/m/d/51cd0790071e1666bdb9d00c57fcf960.pdf?src-supplier=Allied+Electronics; ComponentLink2URL: http://www.industrial.panasonic.com/www-data/pdf/AOA0000/AOA0000CE1.pdf?src-supplier=Element14; ComponentLink2Description: http://www.industrial.panasonic.com/www-data/pdf/AOA0000/AOA0000CE1.pdf?src-supplier=Element14; ComponentLink3URL: http://www.farnell.com/datasheets/2059623.pdf?src-supplier=Farnell; ComponentLink3Description: http://www.farnell.com/datasheets/2059623.pdf?src-supplier=Farnell; ComponentLink4URL: http://industrial.panasonic.com/www-data/pdf/AOA0000/AOA0000CE1.pdf?src-supplier=Avnet; ComponentLink4Description: http://industrial.panasonic.com/www-data/pdf/AOA0000/AOA0000CE1.pdf?src-supplier=Avnet; ComponentLink5URL: http://www.farnell.com/datasheets/1678796.pdf?src-supplier=Element14; ComponentLink5Description: http://www.farnell.com/datasheets/1678796.pdf?src-supplier=Element14; ComponentLink6URL: http://datasheet.octopart.com/ERJ-2GEJ150X-Panasonic-datasheet-61114972.pdf?src-supplier=Farnell; ComponentLink6Description: http://datasheet.octopart.com/ERJ-2GEJ150X-Panasonic-datasheet-61114972.pdf?src-supplier=Farnell; ComponentLink7URL: http://datasheet.octopart.com/ERJ-2GEJ150X-Panasonic-datasheet-13266872.pdf?src-supplier=Allied+Electronics; ComponentLink7Description: http://datasheet.octopart.com/ERJ-2GEJ150X-Panasonic-datasheet-13266872.pdf?src-supplier=Allied+Electronics; ComponentLink8URL: http://datasheet.octopart.com/ERJ-2GEJ150X-Panasonic-datasheet-5314550.pdf?src-supplier=Farnell; ComponentLink8Description: http://datasheet.octopart.com/ERJ-2GEJ150X-Panasonic-datasheet-5314550.pdf?src-supplier=Farnell; ComponentLink9URL: http://datasheet.octopart.com/ERJ-2GEJ150X-Panasonic-datasheet-33006990.pdf?src-supplier=Newark; ComponentLink9Description: http://datasheet.octopart.com/ERJ-2GEJ150X-Panasonic-datasheet-33006990.pdf?src-supplier=Newark; ComponentLink10URL: http://datasheet.octopart.com/ERJ-2GEJ150X-Panasonic-datasheet-37173568.pdf?src-supplier=Electro+Sonic; ComponentLink10Description: http://datasheet.octopart.com/ERJ-2GEJ150X-Panasonic-datasheet-37173568.pdf?src-supplier=Electro+Sonic; ComponentLink11URL: http://datasheet.octopart.com/ERJ-2GEJ150X-Panasonic-datasheet-78375410.pdf; ComponentLink11Description: http://datasheet.octopart.com/ERJ-2GEJ150X-Panasonic-datasheet-78375410.pdf; ComponentLink12URL: http://datasheet.octopart.com/ERJ-2GEJ150X-Panasonic-datasheet-118598.pdf?src-supplier=Digi-Key; ComponentLink12Description: http://datasheet.octopart.com/ERJ-2GEJ150X-Panasonic-datasheet-118598.pdf?src-supplier=Digi-Key; ComponentLink13URL: http://datasheet.octopart.com/ERJ-2GEJ150X-Panasonic---ECG-datasheet-15994758.pdf?src-supplier=Farnell; ComponentLink13Description: http://datasheet.octopart.com/ERJ-2GEJ150X-Panasonic---ECG-datasheet-15994758.pdf?src-supplier=Farnell; ComponentLink14URL: http://datasheet.octopart.com/ERJ-2GEJ150X-Panasonic---ECG-datasheet-21211697.pdf?src-supplier=Newark; ComponentLink14Description: http://datasheet.octopart.com/ERJ-2GEJ150X-Panasonic---ECG-datasheet-21211697.pdf?src-supplier=Newark; ComponentLink15URL: http://datasheet.octopart.com/ERJ2GEJ150X-Panasonic-datasheet-27908757.pdf?src-supplier=Electro+Sonic; ComponentLink15Description: http://datasheet.octopart.com/ERJ2GEJ150X-Panasonic-datasheet-27908757.pdf?src-supplier=Electro+Sonic; Supplier Part Number 1: ERJ-2GEJ150X
R2 = RK73B1ETTP511J: Res Thick Film 0402 510 Ohm 5% 0.1W(1/10W) ±200ppm/C Pad SMD Automotive T/R; Manufacturer: KOA Speer; Power Rating: 63mW; Voltage Rating: 50V; Temperature Coefficient: 200ppm/°C; Supplier 1: Arrow; Manufacturer Part Number: RK73B1ETTP511J; Stock 1: 9725; Pricing 1: 1 = 0.00090, 500 = 0.00080 (USD); Mount: Surface Mount; Case/Package: 0402; Case Code (Imperial): 0402; Case Code (Metric): 1005; Min Operating Temperature: -55°C; Max Operating Temperature: 155°C; Tolerance: 5%; Packaging: Tape and Reel; Package Quantity: 10000; Composition: Thick Film; Termination: SMD/SMT; Military Standard: MIL-R-55342F; Voltage Rating (DC): 50V; Length: 1mm; Height: 0.35mm; Width: 0.5mm; Depth: 0.5mm; Lead Free: Lead Free; ComponentLink1URL: https://www.verical.com/server-webapp/html/getDatasheet?partID=163952&src-supplier=Verical; ComponentLink1Description: https://www.verical.com/server-webapp/html/getDatasheet?partID=163952&src-supplier=Verical; ComponentLink2URL: http://datasheet.octopart.com/RK73B1ETTP511J-KOA-Speer-datasheet-11541631.pdf; ComponentLink2Description: http://datasheet.octopart.com/RK73B1ETTP511J-KOA-Speer-datasheet-11541631.pdf; ComponentLink3URL: http://datasheet.octopart.com/RK73B1ETTP511J-KOA-Speer-datasheet-109291.pdf?src-supplier=Garrett; ComponentLink3Description: http://datasheet.octopart.com/RK73B1ETTP511J-KOA-Speer-datasheet-109291.pdf?src-supplier=Garrett; ComponentLink4URL: http://datasheet.octopart.com/RK73B1ETTP511J-KOA-Speer-datasheet-5377395.pdf?src-supplier=Garrett; ComponentLink4Description: http://datasheet.octopart.com/RK73B1ETTP511J-KOA-Speer-datasheet-5377395.pdf?src-supplier=Garrett; ComponentLink5URL: http://datasheet.octopart.com/RK73B1ETTP511J-KOA-Speer-datasheet-5377795.pdf?src-supplier=Garrett; ComponentLink5Description: http://datasheet.octopart.com/RK73B1ETTP511J-KOA-Speer-datasheet-5377795.pdf?src-supplier=Garrett; ComponentLink6URL: http://datasheet.octopart.com/RK73B1ETTP511J-KOA-Speer-datasheet-11616998.pdf?src-supplier=Garrett; ComponentLink6Description: http://datasheet.octopart.com/RK73B1ETTP511J-KOA-Speer-datasheet-11616998.pdf?src-supplier=Garrett; ComponentLink7URL: http://datasheet.octopart.com/RK73B-%7C-General-Purpose-2%25%2C-5%25-Tolerance-Thick-Film-Chip-Resistor-KOA-Speer-datasheet-family-86.pdf; ComponentLink7Description: http://datasheet.octopart.com/RK73B-%7C-General-Purpose-2%25%2C-5%25-Tolerance-Thick-Film-Chip-Resistor-KOA-Speer-datasheet-family-86.pdf
R3 = ERJ-2GEJ512X: Res Thick Film 0402 5.1K Ohm 5% 1/10W ±200ppm/°C Molded SMD SMD Punched Carrier T/R; Manufacturer: Panasonic; Power Rating: 100mW; Voltage Rating: 50V; Supplier 1: Digi-Key; Manufacturer Part Number: ERJ-2GEJ512X; Stock 1: 1622396; Pricing 1: 1 = 0.10000, 10 = 0.03000, 100 = 0.01230, 1000 = 0.00551, 2500 = 0.00478, 5000 = 0.00395 (USD); Mount: Surface Mount; Case/Package: 0402; Case Code (Metric): 1005; Case Code (Imperial): 0402; Contact Plating: Tin; Min Operating Temperature: -55°C; Max Operating Temperature: 155°C; Tolerance: 5%; Packaging: Tape and Reel; Package Quantity: 1; Composition: Thick Film; Number of Terminations: 2; Termination: SMD/SMT; Military Standard: Not; Temperature Coefficient: 200ppm/°C; Max Power Dissipation: 100mW; Voltage Rating (DC): 50V; Length: 1mm; Height: 0.35mm; Width: 0.02inch; Depth: 0.5mm; Radiation Hardening: No; REACH SVHC: No SVHC; Lead Free: Lead Free; ComponentLink1URL: http://industrial.panasonic.com/www-data/pdf/AOA0000/AOA0000CE1.pdf?src-supplier=Avnet; ComponentLink1Description: http://industrial.panasonic.com/www-data/pdf/AOA0000/AOA0000CE1.pdf?src-supplier=Avnet; ComponentLink2URL: https://www.alliedelec.com/m/d/51cd0790071e1666bdb9d00c57fcf960.pdf?src-supplier=Allied+Electronics; ComponentLink2Description: https://www.alliedelec.com/m/d/51cd0790071e1666bdb9d00c57fcf960.pdf?src-supplier=Allied+Electronics; ComponentLink3URL: http://www.farnell.com/datasheets/1500035.pdf?src-supplier=Element14; ComponentLink3Description: http://www.farnell.com/datasheets/1500035.pdf?src-supplier=Element14; ComponentLink4URL: http://datasheet.octopart.com/ERJ-2GEJ512X-Panasonic-datasheet-13266872.pdf?src-supplier=Newark; ComponentLink4Description: http://datasheet.octopart.com/ERJ-2GEJ512X-Panasonic-datasheet-13266872.pdf?src-supplier=Newark; ComponentLink5URL: http://datasheet.octopart.com/ERJ-2GEJ512X-Panasonic-datasheet-61114972.pdf?src-supplier=Farnell; ComponentLink5Description: http://datasheet.octopart.com/ERJ-2GEJ512X-Panasonic-datasheet-61114972.pdf?src-supplier=Farnell; ComponentLink6URL: http://datasheet.octopart.com/ERJ-2GEJ512X-Panasonic-datasheet-5314550.pdf?src-supplier=Element14; ComponentLink6Description: http://datasheet.octopart.com/ERJ-2GEJ512X-Panasonic-datasheet-5314550.pdf?src-supplier=Element14; ComponentLink7URL: http://datasheet.octopart.com/ERJ-2GEJ512X-Panasonic-datasheet-37173568.pdf?src-supplier=Electro+Sonic; ComponentLink7Description: http://datasheet.octopart.com/ERJ-2GEJ512X-Panasonic-datasheet-37173568.pdf?src-supplier=Electro+Sonic; ComponentLink8URL: http://datasheet.octopart.com/ERJ-2GEJ512X-Panasonic-datasheet-78375410.pdf; ComponentLink8Description: http://datasheet.octopart.com/ERJ-2GEJ512X-Panasonic-datasheet-78375410.pdf; ComponentLink9URL: http://datasheet.octopart.com/ERJ-2GEJ512X-Panasonic-datasheet-118598.pdf?src-supplier=Digi-Key; ComponentLink9Description: http://datasheet.octopart.com/ERJ-2GEJ512X-Panasonic-datasheet-118598.pdf?src-supplier=Digi-Key; ComponentLink10URL: http://datasheet.octopart.com/ERJ-2GEJ512X-Panasonic-datasheet-5313456.pdf?src-supplier=Farnell; ComponentLink10Description: http://datasheet.octopart.com/ERJ-2GEJ512X-Panasonic-datasheet-5313456.pdf?src-supplier=Farnell; ComponentLink11URL: http://datasheet.octopart.com/ERJ-2GEJ512X-Panasonic-datasheet-10554283.pdf?src-supplier=Farnell; ComponentLink11Description: http://datasheet.octopart.com/ERJ-2GEJ512X-Panasonic-datasheet-10554283.pdf?src-supplier=Farnell; ComponentLink12URL: http://datasheet.octopart.com/ERJ-2GEJ512X-Panasonic---ECG-datasheet-15994758.pdf?src-supplier=Farnell; ComponentLink12Description: http://datasheet.octopart.com/ERJ-2GEJ512X-Panasonic---ECG-datasheet-15994758.pdf?src-supplier=Farnell; ComponentLink13URL: http://datasheet.octopart.com/ERJ2GEJ512X-Panasonic-datasheet-27908757.pdf?src-supplier=Electro+Sonic; ComponentLink13Description: http://datasheet.octopart.com/ERJ2GEJ512X-Panasonic-datasheet-27908757.pdf?src-supplier=Electro+Sonic; Supplier Part Number 1: P5.1KJCT-ND